# EAGLE schematic 7ChannelSpectrumAnalyzer (EAGLE 6.3)
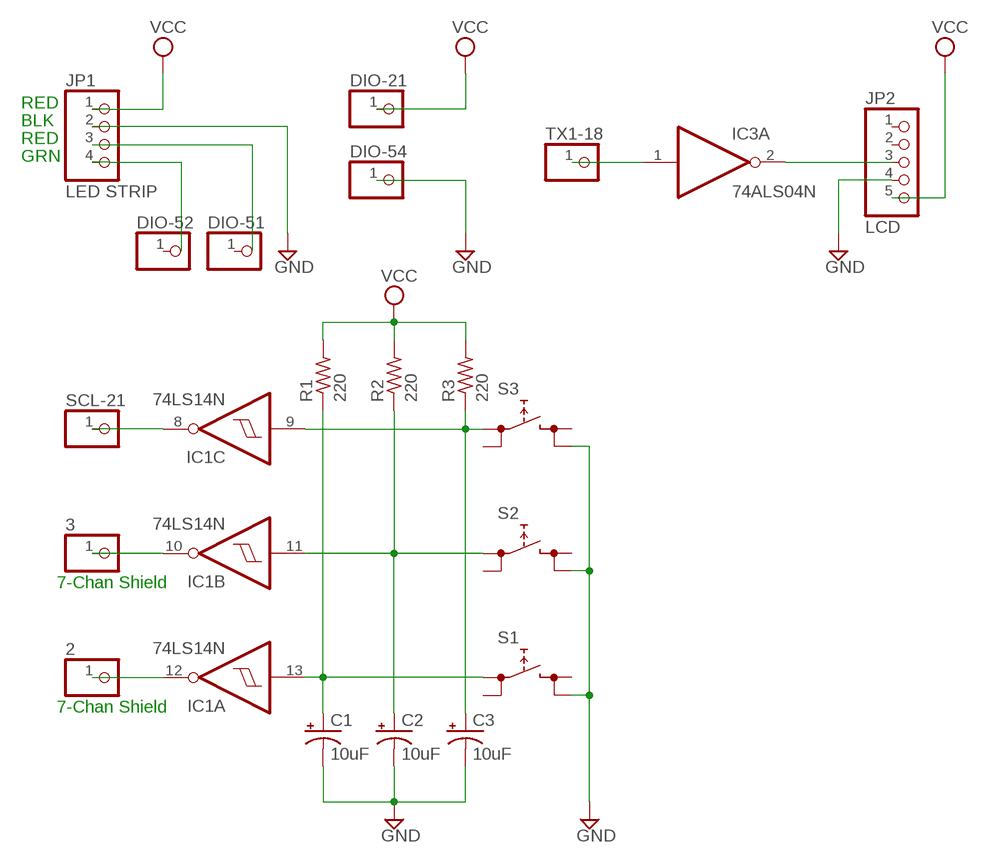
[diagram p0: schematic, sheet 1]

## Parts
2  PINHD-1X1  [1X01]
3  PINHD-1X1  [1X01]
C1  10uF  CPOL-USE5-8.5  [E5-8,5]
C2  10uF  CPOL-USE5-8.5  [E5-8,5]
C3  10uF  CPOL-USE5-8.5  [E5-8,5]
DIO-21  PINHD-1X1  [1X01]
DIO-51  PINHD-1X1  [1X01]
DIO-52  PINHD-1X1  [1X01]
DIO-54  PINHD-1X1  [1X01]
IC1  74LS14N  [DIL14]
IC3  74ALS04N  [DIL14]
JP1  LED STRIP  PINHD-1X4  [1X04]
JP2  LCD  PINHD-1X5  [1X05]
R1  220  R-US_0204/7  [0204/7]
R2  220  R-US_0204/7  [0204/7]
R3  220  R-US_0204/7  [0204/7]
S1  REKN  [REKN]
S2  REKN  [REKN]
S3  REKN  [REKN]
SCL-21  PINHD-1X1  [1X01]
TX1-18  PINHD-1X1  [1X01]

## Nets
A52: JP1.3
A53: JP1.4
GND: C1.- C2.- C3.- DIO-54.1 JP1.2 JP2.4 S1.1B S2.1B S3.1B
N$1: IC1.8(C:O) SCL-21.1
N$2: IC3.2(A:O) JP2.3
N$3: IC3.1(A:I) TX1-18.1
N$5: C1.+ IC1.13(A:I) R1.1 S1.0A
N$6: C3.+ IC1.9(C:I) R3.1 S3.0A
N$9: C2.+ IC1.11(B:I) R2.1 S2.0A
N$10: 3.1 IC1.10(B:O)
N$11: 2.1 IC1.12(A:O)
VCC: DIO-21.1 JP1.1 JP2.5 R1.2 R2.2 R3.2
Unconnected: DIO-51.1 DIO-52.1 IC1.1(D:I) IC1.2(D:O) IC1.3(E:I) IC1.4(E:O) IC1.5(F:I) IC1.6(F:O) IC3.3(B:I) IC3.4(B:O) IC3.5(C:I) IC3.6(C:O) IC3.8(D:O) IC3.9(D:I) IC3.10(E:O) IC3.11(E:I) IC3.12(F:O) IC3.13(F:I) JP2.1 JP2.2 S1.0B S1.1A S2.0B S2.1A S3.0B S3.1A

## Notes on the sheet
- RED
- BLK
- RED
- GRN
- 7-Chan Shield
- 7-Chan Shield

## Power pins joined to a net without a drawn wire
GND: IC1.7(P:GND) IC3.7(P:GND)
VCC: IC1.14(P:VCC) IC3.14(P:VCC)

## Library data of the parts
2 3 DIO-21 DIO-51 DIO-52 DIO-54 SCL-21 TX1-18 = pinhead:PINHD-1X1: PIN HEADER
C1-C3 = resistor:CPOL-US: POLARIZED CAPACITOR, American symbol
IC1 = 74xx-eu:74*14: Hex schmitt trigger INVERTER
IC3 = 74xx-us:74*04: Hex INVERTER
JP1 = pinhead:PINHD-1X4: PIN HEADER
JP2 = pinhead:PINHD-1X5: PIN HEADER
R1-R3 = resistor:R-US_: RESISTOR, American symbol
S1-S3 = switch:REKN: PUSH SWITCH ITT-Cannon-Cannon